# EAGLE design meld_all_non_inv (EAGLE 7.5.0)
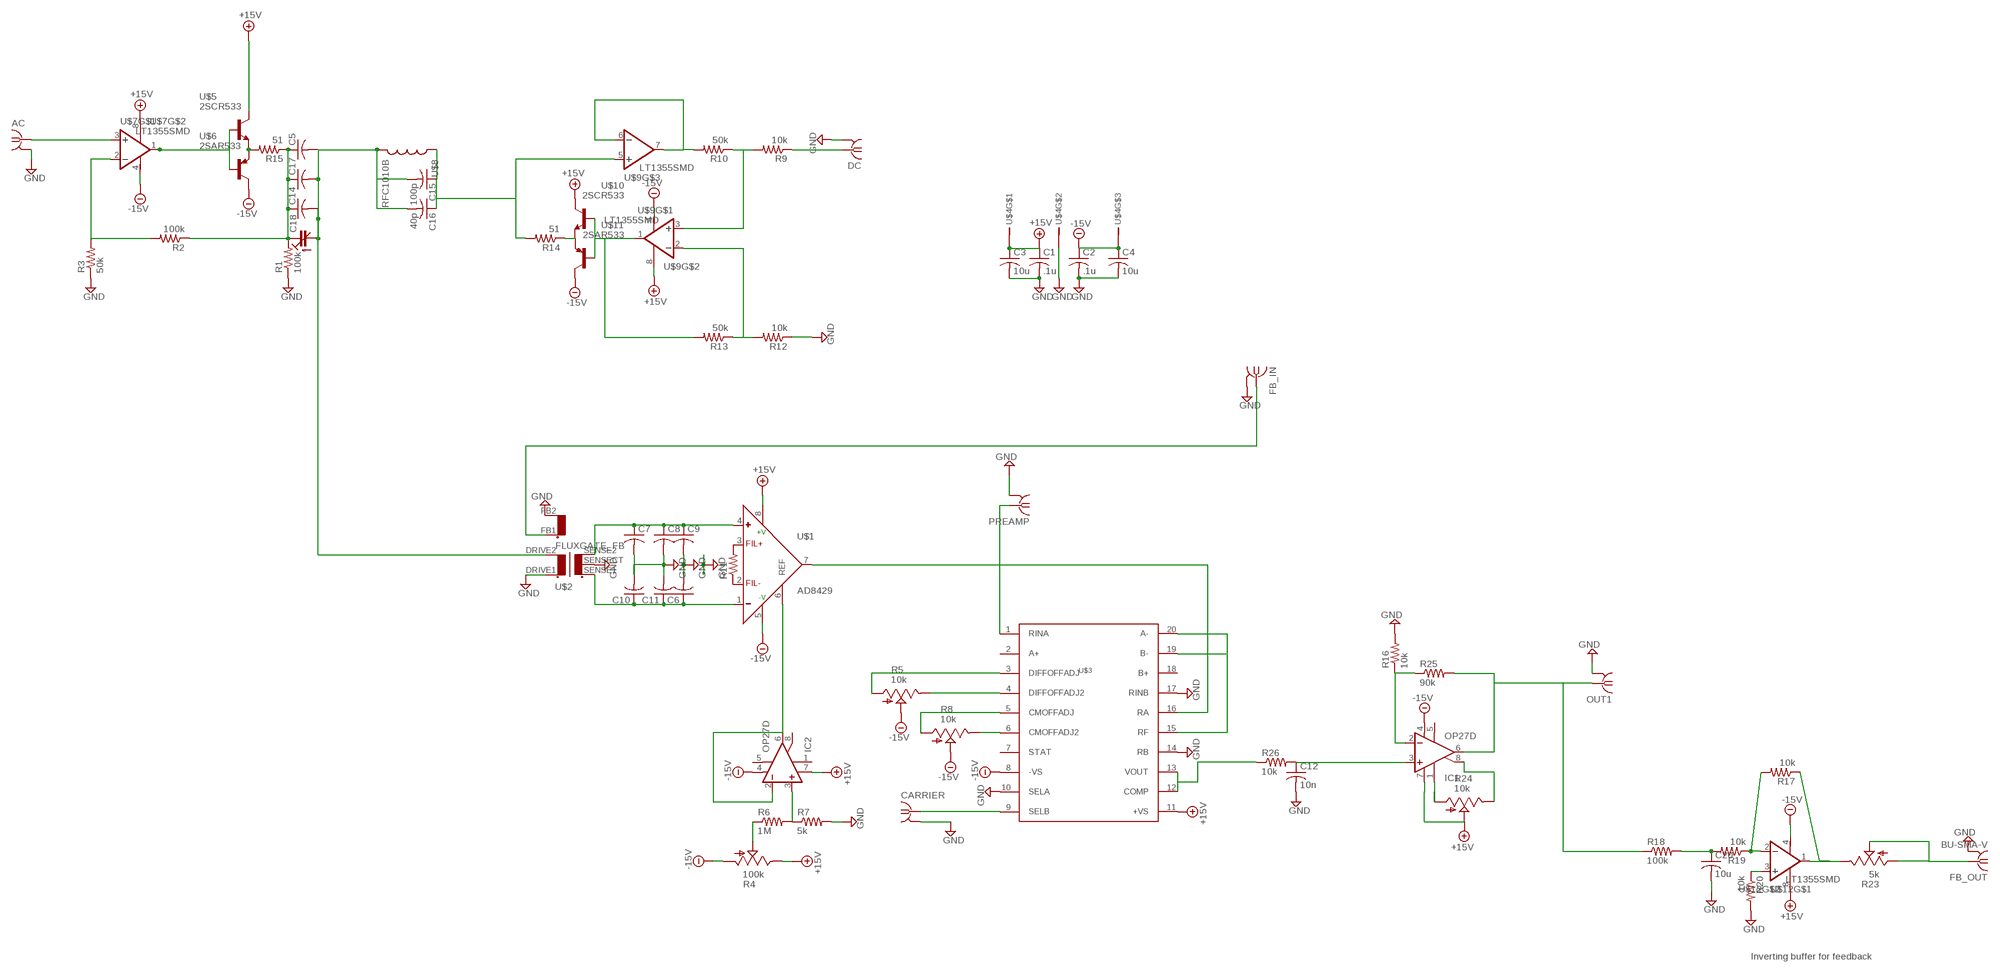
[diagram p0: schematic, sheet 1]

## Parts
AC  SMA-142-0701-851/861  [J502-ND-142-0701-851/861]
C1  .1u  C-USC1206  [C1206]
C2  .1u  C-USC1206  [C1206]
C3  10u  C-USC1206  [C1206]
C4  10u  C-USC1206  [C1206]
C5  C-USC0805  [C0805]
C6  C-USC0805  [C0805]
C7  C-USC0805  [C0805]
C8  C-USC0805  [C0805]
C9  C-USC0805  [C0805]
C10  C-USC0805  [C0805]
C11  C-USC0805  [C0805]
C12  10n  C-USC0805  [C0805]
C14  C-USC0805  [C0805]
C15  100p  C-USC0805  [C0805]
C16  40p  C-USC0805  [C0805]
C17  C-USC0805  [C0805]
C18  C-TRIMM  [SGC3S]
C20  10u  C-USC1206  [C1206]
CARRIER  SMA-142-0701-851/861  [J502-ND-142-0701-851/861]
DC  SMA-142-0701-851/861  [J502-ND-142-0701-851/861]
FB_IN  SMA-142-0701-851/861  [J502-ND-142-0701-851/861]
FB_OUT  BU-SMA-V  [BU-SMA-V]
IC1  OP27D  [SO08]
IC2  OP27D  [SO08]
OUT1  SMA-142-0701-851/861  [J502-ND-142-0701-851/861]
PREAMP  SMA-142-0701-851/861  [J502-ND-142-0701-851/861]
R1  100k  R-US_R0805  [R0805]
R2  100k  R-US_R0805  [R0805]
R3  50k  R-US_R0805  [R0805]
R4  100k  TRIM_US-B64Y  [B64Y]
R5  10k  TRIM_US-B64Y  [B64Y]
R6  1M  R-US_R0805  [R0805]
R7  5k  R-US_R0805  [R0805]
R8  10k  TRIM_US-B64Y  [B64Y]
R9  10k  R-US_R0805  [R0805]
R10  50k  R-US_R0805  [R0805]
R11  R-US_R0805  [R0805]
R12  10k  R-US_R0805  [R0805]
R13  50k  R-US_R0805  [R0805]
R14  51  R-US_R2512  [R2512]
R15  51  R-US_R2512  [R2512]
R16  10k  R-US_R0805  [R0805]
R17  10k  R-US_R0805  [R0805]
R18  100k  R-US_R0805  [R0805]
R19  10k  R-US_R0805  [R0805]
R20  10k  R-US_R0805  [R0805]
R23  5k  TRIM_US-B64Y  [B64Y]
R24  10k  TRIM_US-B64Y  [B64Y]
R25  90k  R-US_R0805  [R0805]
R26  10k  R-US_R0805  [R0805]
U$1  AD8429  AD8428  [SO8]
U$2  FLUXGATE_FB  [PARA_FB]
U$3  AD630  [SOIC20R]
U$4  B3B-AM  [B3B-AM]
U$5  2SCR533  [SOT89-BCE]
U$6  2SAR533  [SOT89-BCE]
U$7  LT1355SMD  [SOIC8]
U$8  RFC1010B  [186KE]
U$9  LT1355SMD  [SOIC8]
U$10  2SCR533  [SOT89-BCE]
U$11  2SAR533  [SOT89-BCE]
U$12  LT1355SMD  [SOIC8]

## Nets
+15V [power]: C1.1 C3.1 IC1.7(V+) IC2.7(V+) R4.E R24.S U$1.8(+V) U$3.11(+VS) U$4.1 U$5.C U$7.8(V+) U$9.8(V+) U$10.C U$12.8(V+)
-15V [power]: C2.1 C4.1 IC1.4(V-) IC2.4(V-) R4.A R5.S R8.S U$1.5(-V) U$3.8(-VS) U$4.3 U$6.C U$7.4(V-) U$9.4(V-) U$11.C U$12.4(V-)
GND [power]: AC.G@1 AC.G@2 AC.G@3 AC.G@4 C1.2 C2.2 C3.2 C4.2 C6.2 C7.2 C8.2 C9.2 C10.2 C11.2 C12.2 C20.2 CARRIER.G@1 CARRIER.G@2 CARRIER.G@3 CARRIER.G@4 DC.G@1 DC.G@2 DC.G@3 DC.G@4 FB_IN.G@1 FB_IN.G@2 FB_IN.G@3 FB_IN.G@4 FB_OUT.2 FB_OUT.3 FB_OUT.4 FB_OUT.5 OUT1.G@1 OUT1.G@2 OUT1.G@3 OUT1.G@4 PREAMP.G@1 PREAMP.G@2 PREAMP.G@3 PREAMP.G@4 R1.1 R3.1 R7.2 R12.1 R16.2 R20.2 U$2.DRIVE1 U$2.FB2 U$2.SENSECT U$3.10(SELA) U$3.14(RB) U$3.17(RINB) U$4.2
N$1: C7.1 C8.1 C9.1 U$1.4(+) U$2.SENSE2
N$2: C6.1 C10.1 C11.1 U$1.1(-) U$2.SENSE1
N$3: R11.2 U$1.3(FIL+)
N$4: PREAMP.1 U$1.7(OUT) U$3.1(RINA) U$3.16(RA)
N$5: CARRIER.1 U$3.9(SELB)
N$6: R15.2 U$5.E U$6.E
N$7: U$3.15(RF) U$3.19(B-) U$3.20(A-)
N$8: U$5.B U$6.B U$7.1(OUT)
N$9: C20.1 R18.2 R19.2
N$10: FB_OUT.1 R23.A R23.S
N$11: R2.2 R3.2 U$7.2(-IN)
N$12: R5.A U$3.3(DIFFOFFADJ)
N$13: IC2.2(-IN) IC2.6(OUT) U$1.6(REF)
N$14: IC2.3(+IN) R6.2 R7.1
N$15: R4.S R6.1
N$16: R5.E U$3.4(DIFFOFFADJ2)
N$17: R8.A U$3.5(CMOFFADJ)
N$18: R8.E U$3.6(CMOFFADJ2)
N$19: FB_IN.1 U$2.FB1
N$20: C5.1 C14.1 C17.1 C18.P$2(E) R1.2 R2.1 R15.1
N$21: AC.1 U$7.3(+IN)
N$22: R11.1 U$1.2(FIL-)
N$23 [power]: C5.2 C14.2 C15.2 C16.2 C17.2 C18.P$1(A) U$2.DRIVE2 U$8.P$2
N$24: R14.1 U$10.E U$11.E
N$25: R13.2 U$9.1(OUT) U$10.B U$11.B
N$26: R10.2 U$9.6(-IN) U$9.7(OUT)
N$27: R9.2 R10.1 U$9.3(+IN)
N$28: DC.1 R9.1
N$29: R12.2 R13.1 U$9.2(-IN)
N$30: C15.1 C16.1 R14.2 U$8.P$1 U$9.5(+IN)
N$31: IC1.2(-IN) R16.1 R25.1
N$32: IC1.6(OUT) OUT1.1 R18.1 R25.2
N$33: R17.2 R19.1 U$12.2(-IN)
N$34: R26.1 U$3.12(COMP) U$3.13(VOUT)
N$35: C12.1 IC1.3(+IN) R26.2
N$36: R17.1 R23.E U$12.1(OUT)
N$37 [power]: R20.1 U$12.3(+IN)
N$42: IC1.1(ON1) R24.A
N$43: IC1.8(ON2) R24.E
Unconnected: IC1.5(OPT) IC2.1(ON1) IC2.5(OPT) IC2.8(ON2) U$3.2(A+) U$3.7(STAT) U$3.18(B+) U$7.5(+IN) U$7.6(-IN) U$7.7(OUT) U$12.5(+IN) U$12.6(-IN) U$12.7(OUT)

## Notes on the sheet
- Inverting buffer for feedback

## Library data of the parts
AC CARRIER DC FB_IN OUT1 PREAMP = con-coax:SMA-: SMA 50 Ohm End Launch Jack Receptacle - Round Contact Johnson Components Source: www.johnsoncomponents.com .. J502-ND.pdf; MF: JOHNSON COMPONENTS; MPN: 142-0701-851; OC_FARNELL: 1019325; OC_NEWARK: 99F6798
C1-C12 C14-C17 C20 = rcl:C-US: CAPACITOR, American symbol
C18 = sprague:C-TRIMM: Trimm capacitor
FB_OUT = con-coax:BU-SMA-V: FEMALE SMA CONNECTOR Radiall distributor RS 112-3794; OC_FARNELL: unknown; OC_NEWARK: unknown
IC1 IC2 = linear:OP27: OP AMP
R1-R3 R6 R7 R9-R15 = rcl:R-US_: RESISTOR, American symbol
R4 R5 R8 R23 R24 = pot:TRIM_US-: POTENTIOMETER
R16-R20 R25 R26 = resistor:R-US_: RESISTOR, American symbol
U$1 = analog-devices:AD8428
U$2 = darpa:FLUXGATE_FB
U$3 = analog-devices:AD630
U$4 = con-jst:B3B-AM
U$5 U$10 = transistor:2SCR533
U$6 U$11 = transistor:2SAR533
U$7 U$9 U$12 = linear-technology:LT1355
U$8 = inductor-coilcraft:RFC1010B

## Net classes
0 default: width 0.406 mm
1 power: width 0.61 mm

## Board
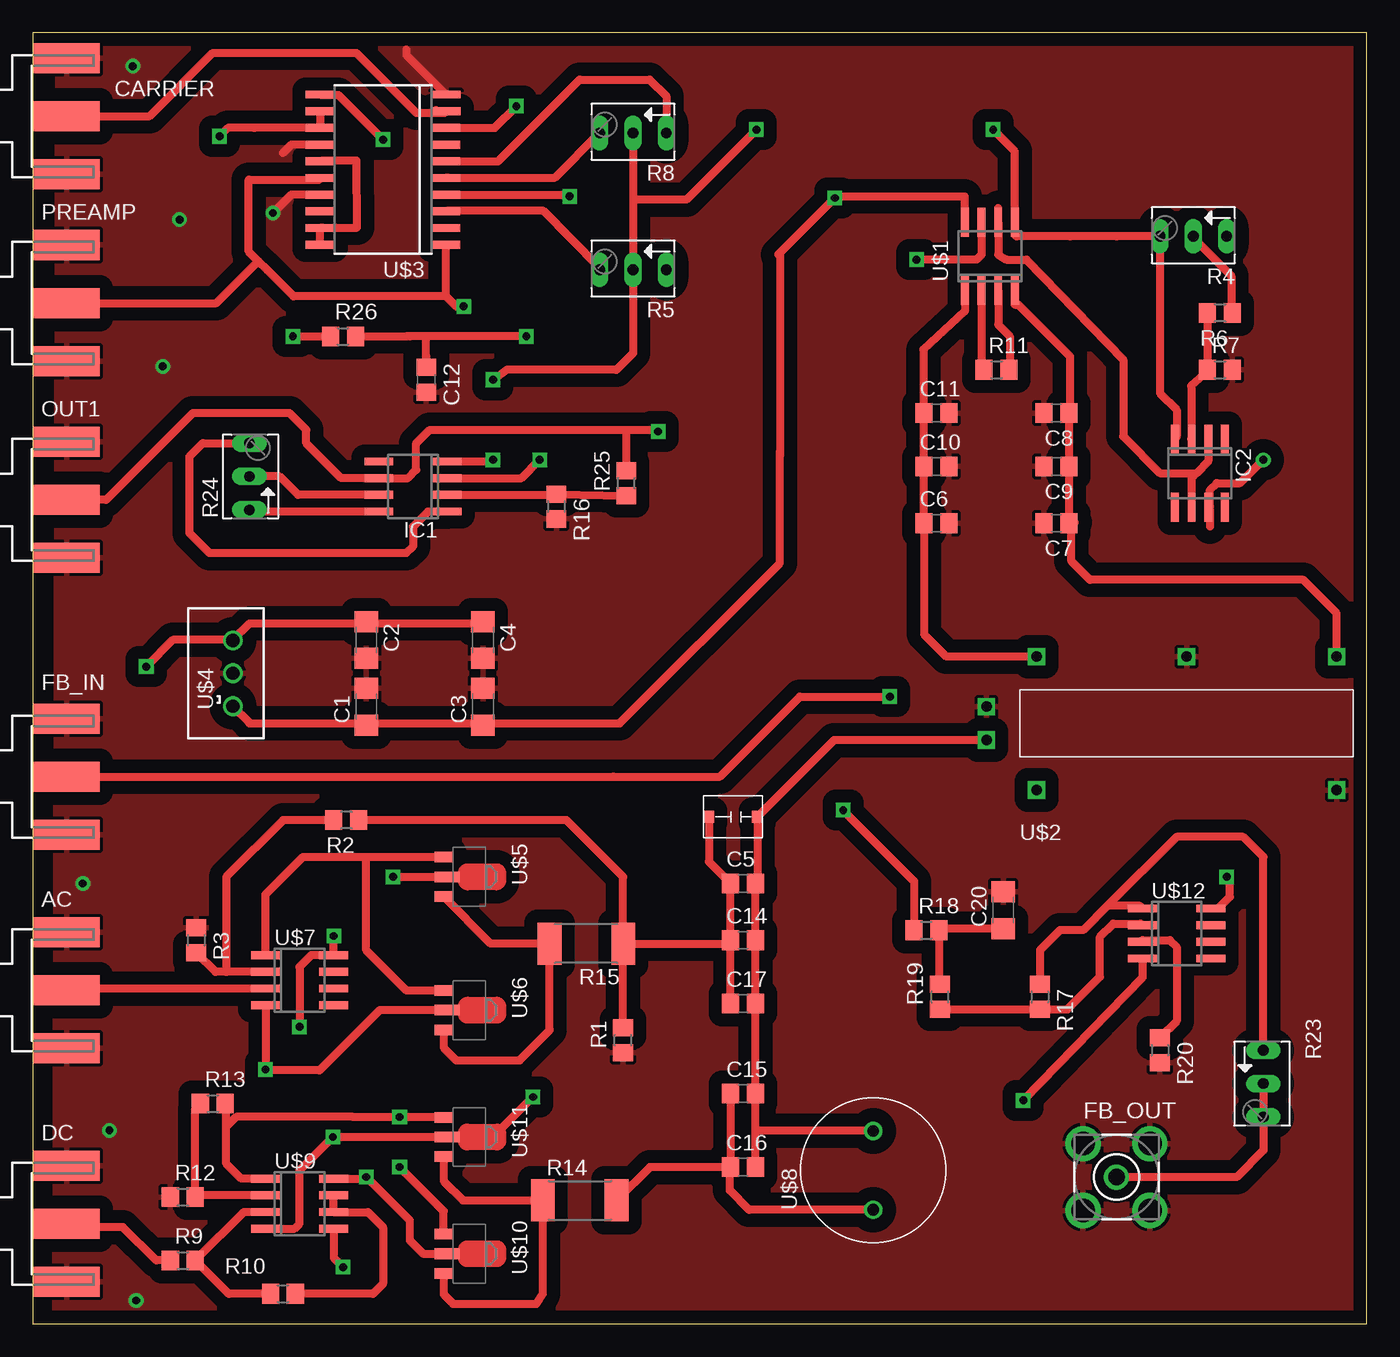
[diagram p1: board, top side]
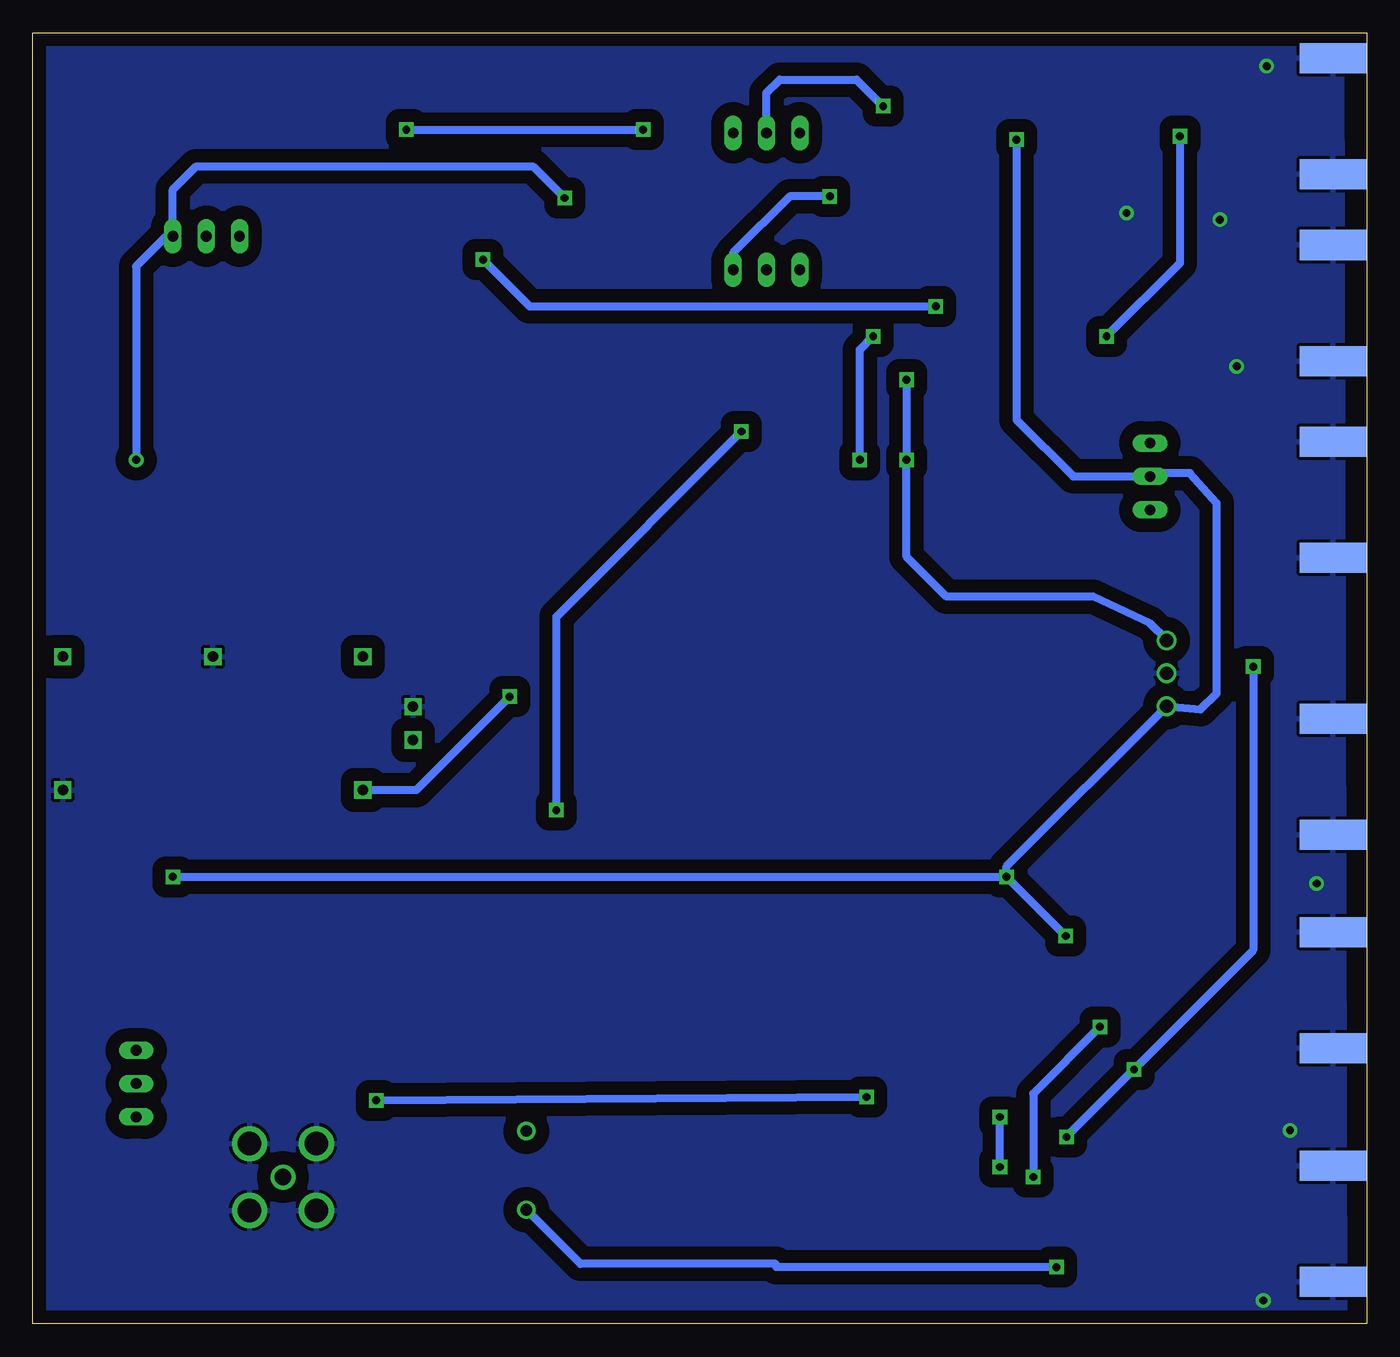
[diagram p2: board, bottom side, seen from below]

Size 101.6 x 98.3 mm. Coordinates in mm from the lower left corner, seen from the top.
Outline: 0,0 101.6,0 101.6,98.3 0,98.3 0,0
Copper layers (1*16): Top 0.035mm / dielectric 1.5mm / Bottom 0.035mm
Design rules "bac *": minimum track width 10mil, minimum drill 10mil, track to track 5mil, track to pad 10mil, pad to pad 10mil, via to via 10mil, smd to smd 10mil, copper to edge 40mil, drill to drill 10mil, minimum pad ring 10mil, minimum via ring 10mil, stop-mask expansion 4mil, vias tented up to drill 0mil, thermal gap 10mil

### Footprints (pad centres in the part's own frame; a part is rotated, then mirrored left to right if it is on the bottom)
J502-ND-142-0701-851/861 = smd 5.08 x 2.286: 1 2.565,0; G@1 2.565,4.42; G@2 2.565,-4.42 | smd 5.08 x 2.286 bottom: G@3 2.565,4.42; G@4 2.565,-4.42
C1206 = smd 1.6 x 1.8: 1 -1.4,0; 2 1.4,0
C0805 = smd 1.3 x 1.5: 1 -0.95,0; 2 0.95,0
SGC3S = smd 0.9 x 0.8: P$1 0,1.85; P$2 0,-1.85
BU-SMA-V = drill 1.27: 1 0,0 | drill 1.778: 2 -2.55,2.55; 3 2.55,2.55; 4 2.55,-2.55; 5 -2.55,-2.55
SO08 = smd 0.6 x 2.2: 1 -1.905,-2.6; 2 -0.635,-2.6; 3 0.635,-2.6; 4 1.905,-2.6; 5 1.905,2.6; 6 0.635,2.6; 7 -0.635,2.6; 8 -1.905,2.6
R0805 = smd 1.3 x 1.5: 1 -0.95,0; 2 0.95,0
B64Y = drill 0.813 long: A 2.54,0; E -2.54,0; S 0,0
R2512 = smd 1.8 x 3.2: 1 -2.8,0; 2 2.8,0
SO8 = smd 0.6 x 2.2: 1 -1.905,-2.6; 2 -0.635,-2.6; 3 0.635,-2.6; 4 1.905,-2.6; 5 1.905,2.6; 6 0.635,2.6; 7 -0.635,2.6; 8 -1.905,2.6
PARA_FB = drill 0.8 square: DRIVE1 1.27,-2.54; DRIVE2 3.81,-2.54; FB1 7.62,1.27; FB2 7.62,24.13; SENSE1 -2.54,1.27; SENSE2 -2.54,24.13; SENSECT -2.54,12.7
SOIC20R = smd 0.6 x 2.2: 1 -5.715,-4.775; 2 -4.445,-4.775; 3 -3.175,-4.775; 4 -1.905,-4.775; 5 -0.635,-4.775; 6 0.635,-4.775; 7 1.905,-4.775; 8 3.175,-4.775; 9 4.445,-4.8; 10 5.715,-4.8; 11 5.715,4.8; 12 4.445,4.8; 13 3.175,4.8; 14 1.905,4.8; 15 0.635,4.8; 16 -0.635,4.8; 17 -1.905,4.8; 18 -3.175,4.8; 19 -4.445,4.8; 20 -5.715,4.8
B3B-AM = drill 1: 1 -2.5,0; 2 0,0; 3 2.5,0
SOT89-BCE = smd 0.8 x 1.4: B -1.499,-1.981; E 1.499,-1.981 | smd 0.8 x 1.9: C 0,-1.727
SOIC8 = smd 0.6 x 2.2: 1 -1.905,-2.6; 2 -0.635,-2.6; 3 0.635,-2.6; 4 1.905,-2.6; 5 1.905,2.6; 6 0.635,2.6; 7 -0.635,2.6; 8 -1.905,2.6
186KE = drill 0.9: P$1 -3,0; P$2 3,0

### Placement (x,y rotation side)
AC  0,25.4 0 top
C1  25.4,46.99 90 top
C2  25.4,52.07 270 top
C3  34.29,46.99 90 top
C4  34.29,52.07 270 top
C5  54.1,33.53 0 top
C6  68.83,60.96 0 top
C7  77.98,60.96 180 top
C8  77.98,69.34 180 top
C9  77.98,65.28 180 top
C10  68.83,65.28 0 top
C11  68.83,69.34 0 top
C12  29.97,71.88 270 top
C14  54.1,29.21 0 top
C15  54.1,17.53 0 top
C16  54.1,11.94 0 top
C17  54.1,24.38 0 top
C18  53.34,38.61 270 top
C20  73.91,31.5 90 top
CARRIER  0,91.95 0 top
DC  0,7.62 0 top
FB_IN  0,41.66 0 top
FB_OUT  82.55,11.18 0 top
IC1  28.96,63.75 90 top
IC2  88.9,64.77 180 top
OUT1  0,62.74 0 top
PREAMP  0,77.72 0 top
R1  44.96,21.59 90 top
R2  23.88,38.35 180 top
R3  12.45,29.21 270 top
R4  88.39,82.8 180 top
R5  45.72,80.26 180 top
R6  90.42,76.96 180 top
R7  90.42,72.64 0 top
R8  45.72,90.68 180 top
R9  11.43,4.83 0 top
R10  19.05,2.29 0 top
R11  73.41,72.64 0 top
R12  11.43,9.65 0 top
R13  13.72,16.76 0 top
R14  41.66,9.4 0 top
R15  42.16,28.96 180 top
R16  39.88,62.23 270 top
R17  76.71,24.89 270 top
R18  68.07,29.97 0 top
R19  69.09,24.89 90 top
R20  85.85,20.83 270 top
R23  93.73,18.29 270 top
R24  16.51,64.52 90 top
R25  45.21,64.01 90 top
R26  23.62,75.18 0 top
U$1  72.9,81.28 0 top
U$2  75.18,48.26 270 top
U$3  26.67,87.88 90 top
U$4  15.24,49.53 90 top
U$5  33.27,34.04 270 top
U$6  33.27,23.88 270 top
U$7  20.32,26.16 270 top
U$8  64.01,11.68 90 top
U$9  20.32,9.14 270 top
U$10  33.27,5.33 270 top
U$11  33.27,14.22 270 top
U$12  87.12,29.72 270 top

### Tracks (layer width: path | path; a pad name or v marks a point on that pad's centre or on a via)
+15V  (via drill 0.6)
  Top 0.61: 25.4,45.72 16.51,45.72 16.51,45.76 U$4.1 15.2,47.03 | 25.4,45.72 34.29,45.72 | 34.29,45.72 C3.1 | 25.4,45.72 C1.1 | v26.67,90.17 23.27,93.57 22,93.57 U$3.11 | v93.73,65.79 91.95,64.01 90.17,64.01 89.66,63.5 89.66,62.23 IC2.7 89.66,61.98 89.66,60.71 | U$1.8 70.99,85.83 70.97,85.85 61.21,85.85 | U$9.8 25.53,11.05 | 25.53,11.05 28.7,7.87 28.7,6.35 29.72,5.33 U$10.C | v22.92,29.52 U$7.8 21.21,28.07 20.32,27.18 v20.32,22.61 | v27.43,34.04 U$5.C | v25.4,11.18 25.53,11.05 | IC1.7 20.19,63.12 18.8,64.52 R24.S | v61.09,85.72 56.77,81.41 56.9,81.41 56.9,66.04 | v61.09,85.72 61.21,85.85 | U$12.8 90.3,31.62 91.19,32.51 91.19,33.78 v90.93,34.04 | 34.29,45.72 44.7,45.72 56.9,57.91 56.9,66.04 | 56.9,66.04 56.9,66.4 | v61.09,85.72 61.21,85.85
  Bottom 0.61: v26.67,90.17 26.67,77.98 26.67,68.83 22.35,64.52 R24.S 16.26,64.77 13.46,64.77 11.43,62.48 11.43,48.01 12.66,46.78 U$4.1 27.43,34.84 v27.43,34.04 | v93.73,65.79 93.73,80.52 91.44,82.8 R4.E 90.93,86.36 89.15,88.14 63.5,88.14 v61.09,85.72 | v22.92,29.52 v27.43,34.04 | v20.32,22.61 25.4,17.53 v25.4,11.18 | v90.93,34.04 37.85,34.04 v27.43,34.04
-15V  (via drill 0.6)
  Top 0.61: 25.4,53.34 18.8,53.34 16.51,53.34 15.24,52.07 | 15.24,52.07 U$4.3 | 25.4,53.34 34.29,53.34 C4.1 | 25.4,53.34 C2.1 | R5.S 45.72,83.06 45.72,85.6 | R5.S 45.72,80.01 45.72,73.91 44.45,72.64 36.07,72.64 v35.05,71.88 | IC2.4 87.12,67.56 87.12,69.6 85.85,70.87 R4.A 82.55,82.8 78.99,82.8 74.93,82.8 | U$1.5 74.8,82.93 | 74.8,82.93 74.93,82.8 | U$9.4 19.94,7.24 20.32,7.62 20.32,11.68 v22.86,14.22 U$11.C 35.05,14.22 v38.1,17.27 | U$7.4 v17.72,19.36 17.78,19.3 21.84,19.3 26.42,23.88 U$6.C | IC1.4 34.92,65.66 v35.05,65.79 | U$12.4 84.52,26.36 v75.44,17.02 | 15.24,52.07 10.67,52.07 v8.64,50.04 | 74.93,82.8 74.8,82.93 | 74.8,82.93 74.8,89.28 v73.15,90.93 | v55.12,90.93 49.78,85.6 45.72,85.6 | R8.S 45.72,85.6 | 45.72,85.6 45.72,83.82 R5.S | U$3.8 35.18,91.06 v36.83,92.71
  Bottom 0.61: v22.86,14.22 v17.72,19.36 17.27,19.81 | v35.05,71.88 v35.05,65.79 35.05,58.42 32,55.37 20.83,55.37 16.51,53.34 15.24,52.07 | v75.44,17.02 v38.1,17.27 | 15.24,52.07 U$4.3 15.24,52.07 | 14.99,22.1 17.27,19.81 | v8.64,50.04 8.64,28.45 17.27,19.81 | v73.15,90.93 v55.12,90.93 | R8.S 45.72,93.73 44.7,94.74 38.86,94.74 37.59,93.47 | 37.59,93.47 v36.83,92.71 37.59,93.47
GND  (via drill 0.6)
  Top 0.61: U$3.17 19.68,85.98 v18.29,84.58 | 28.45,97.03 28.45,96.62 U$3.10 | U$3.14 19.68,89.79 19.05,89.15
  Bottom 0.61: v18.29,84.58 18.03,84.58
  other vias: 11.18,84.07 9.91,72.9 5.84,14.73 3.81,33.53 7.87,1.78 7.62,95.76
  pour Bottom (isolate 1.016): 1.91,98.3 101.6,98.3 101.35,0 1.65,0
  pour Top (isolate 1.016): 1.91,98.3 101.6,98.3 101.35,0 1.65,0
N$1
  Top 0.61: U$1.4 74.8,77.6 75.06,77.6 78.99,73.66 78.99,69.66 C8.1 C9.1 C7.1 | C7.1 79.18,61.03 79.36,61.03 | C7.1 79.11,60.78 79.11,58.05 80.52,56.64 96.77,56.64 99.31,54.1 U$2.SENSE2
N$2
  Top 0.61: 68.07,69.53 C11.1 67.88,68.83 67.82,68.9 | U$1.1 70.99,77.09 67.82,74.17 67.82,68.9 | 67.82,68.9 67.82,65.02 68.07,64.77 67.88,64.96 C10.1 C6.1 67.89,60.2 67.89,52.51 69.6,50.8 U$2.SENSE1
N$3
  Top 0.61: U$1.3 73.53,76.07 74.42,75.18 74.42,72.71 R11.2
N$4  (via drill 0.6)
  Top 0.61: U$3.16 21.84,87.12 16.46,87.12 16.46,81.64 17.17,80.92 | 17.17,80.92 17.88,80.21 19.86,78.23 31.5,78.23 | 31.39,82.04 U$3.1 | 17.17,80.92 13.97,77.72 PREAMP.1 | v67.31,81.03 71.88,81.03 72.26,81.41 U$1.7 | v32.82,77.47 32.26,77.47 31.5,78.23 | 31.5,78.23 31.5,82.12 U$3.1 | U$3.1 31.45,78.28 31.5,78.23
  Bottom 0.61: 63.75,77.47 v67.31,81.03 63.75,77.47 | 63.75,77.47 v32.82,77.47
N$5
  Top 0.61: 30.68,92.41 U$3.9 31.34,92.2 29.21,92.2 24.64,96.77 13.72,96.77 8.89,91.95 CARRIER.1
N$6
  Top 0.61: U$5.E 34.87,28.96 R15.2 39.37,22.35 37.08,20.07 32.26,20.07 31.29,21.03 U$6.E
N$7
  Top 0.61: U$3.15 22.05,88.57 23.06,88.57 24.66,88.57 24.69,83.46 23.06,83.46 22.05,83.46 U$3.19 21.84,83.26 21.84,82.25 U$3.20
N$8
  Top 0.61: U$7.1 17.72,32.71 20.57,35.56 25.4,35.56 | 25.4,35.56 31.27,35.56 U$5.B | U$6.B 28.47,25.38 25.4,28.45 25.4,35.56
N$9
  Top 0.61: 69.02,25.91 R19.2 69.02,25.91 | C20.1 69.15,30.1 R18.2 69.02,25.91
N$10
  Top 0.61: R23.S R23.A 93.73,13.21 91.69,11.18 FB_OUT.1
N$11
  Top 0.61: U$7.2 14.73,26.8 | 14.73,26.8 13.91,26.8 R3.2 | R2.2 19.05,38.35 14.73,34.04 14.73,26.8
N$12
  Top 0.61: U$3.3 31.57,84.73 38.89,84.73 43.18,80.42 R5.A
N$13
  Top 0.61: 73.53,84.96 U$1.6 73.53,81.41 74.17,81.03 75.69,81.03 83.06,73.41 83.06,67.56 85.85,64.77 88.65,64.77 | IC2.2 89.53,65.66 88.65,64.77 | 88.65,64.77 88.39,64.52 | IC2.6 88.27,64.39 88.39,64.52 | 88.65,64.77 88.39,64.52
N$14
  Top 0.61: R6.2 89.46,72.69 R7.1 89.46,72.49 88.24,71.42 88.24,67.36 IC2.3
N$15
  Top 0.61: R6.1 91.29,76.96 91.29,79.81 88.44,82.65 R4.S
N$16  (via drill 0.6)
  Top 0.61: U$3.4 40.77,85.98 v40.89,85.85
  Bottom 0.61: 48.26,80.21 R5.E 48.26,81.53 43.94,85.85 v40.89,85.85
N$17
  Top 0.61: U$3.5 31.6,87.27 39.78,87.27 R8.A
N$18
  Top 0.61: U$3.6 35.43,88.52 41.66,94.74 46.99,94.74 48.26,93.47 R8.E
N$19  (via drill 0.6)
  Top 0.61: FB_IN.1 44.2,41.66 52.32,41.66 58.42,47.75 v65.28,47.75
  Bottom 0.61: v65.28,47.75 72.39,40.64 U$2.FB1
N$20
  Top 0.61: C17.1 C14.1 | C14.1 C5.1 51.49,35.19 C18.P$2 | C14.1 52.9,28.96 R15.1 | R1.2 R15.1 | R15.1 44.96,34.04 40.64,38.35 R2.1
N$21
  Top 0.61: 3.68,25.53 3.56,25.4 AC.1 | AC.1 2.03,25.4 1.78,25.65 | U$7.3 2.31,25.53 AC.1
N$22
  Top 0.61: U$1.2 72.26,72.84 R11.1
N$23
  Top 0.61: 55.32,11.67 C16.2 55.05,14.73 | 55.05,14.73 C15.2 C17.2 C14.2 C5.2 55.19,33.67 C18.P$1 61.03,44.45 U$2.DRIVE2 | U$8.P$2 55.1,14.68 55.05,14.73
N$24
  Top 0.61: U$11.E 31.29,10.87 32.77,9.4 R14.1 38.86,2.29 38.35,1.52 32,1.52 31.29,2.23 U$10.E
N$25  (via drill 0.6)
  Top 0.61: U$9.1 15.88,11.05 14.73,12.19 14.73,14.99 | 14.73,14.99 14.73,16.7 R13.2 | U$11.B 31.27,15.75 v27.94,15.75 24.38,15.75 15.49,15.75 14.73,14.99 | U$10.B 31.29,8.59 v27.94,11.94
  Bottom 0.61: v27.94,11.94 v27.94,15.75
N$26
  Top 0.61: U$9.7 U$9.6 25.53,8.51 26.67,7.37 26.67,3.05 25.91,2.29 R10.2
N$27
  Top 0.61: U$9.3 16.06,8.51 R9.2 14.92,2.29 R10.1
N$28
  Top 0.61: R9.1 9.4,4.83 6.86,7.37 2.82,7.37 DC.1
N$29
  Top 0.61: U$9.2 12.38,9.78 R12.2 12.38,16.38 R13.1
N$30  (via drill 0.6)
  Top 0.61: U$9.5 22.92,5.02 v23.62,4.32 | C15.1 53.15,12.45 | 53.15,12.45 C16.1 47,11.94 R14.2 | U$8.P$1 54.56,8.68 53.09,10.16 53.09,12.38 53.15,12.45
  Bottom 0.61: v23.62,4.32 44.96,4.32 45.01,4.57 59.9,4.57 U$8.P$1
N$31
  Top 0.61: 45.21,63.12 R25.1 R16.1 | 39.62,63.12 R16.1 | IC1.2 39.62,63.12 | 39.62,63.12 R16.1
N$32  (via drill 0.6)
  Top 0.61: 45.21,68.07 30.23,68.07 29.21,67.06 29.21,65.02 28.57,64.39 IC1.6 23.5,64.39 20.83,67.06 20.83,68.07 19.56,69.34 12.19,69.34 5.59,62.74 OUT1.1 | 45.21,68.07 47.5,68.07 v47.62,67.94 | v61.72,39.12 67.12,33.72 R18.1 | R25.2 45.21,68.07
  Bottom 0.61: v61.72,39.12 61.72,53.85 v47.62,67.94
N$33
  Top 0.61: U$12.2 84.39,30.48 82.3,30.48 81.28,29.46 81.28,26.42 78.81,23.94 R17.2 R19.1
N$34  (via drill 0.6)
  Top 0.61: U$3.12 U$3.13 16.89,91.06 14.86,91.06 v14.22,90.42 | v19.81,75.18 R26.1
  Bottom 0.61: v19.81,75.18 14.22,80.77 v14.22,90.42
N$35  (via drill 0.6)
  Top 0.61: R26.2 28.45,75.18 28.7,75.18 29.97,75.18 | IC1.3 37.21,64.39 v38.61,65.79 | v37.59,75.18 29.97,75.18 | 29.97,73.66 29.97,73.41 | 29.72,73.15 29.97,73.15 29.97,73.66 | 29.97,73.66 29.97,75.18 | C12.1 29.97,73.66
  Bottom 0.61: v38.61,65.79 38.61,74.17 v37.59,75.18
N$36
  Top 0.61: U$12.1 84.33,31.82 81.86,31.82 | 81.86,31.82 80.01,29.97 78.23,29.97 76.71,28.45 R17.1 76.58,25.97 | R23.E 93.73,35.56 92.2,37.08 87.12,37.08 81.86,31.82
N$37
  Top 0.61: U$12.3 84.52,29.21 86.61,29.21 87.12,28.7 87.12,23.05 R20.1
N$42
  Top 0.61: IC1.1 30.1,61.85 28.96,60.71 28.96,59.18 28.45,58.67 13.46,58.67 11.94,60.2 11.94,66.04 12.95,67.06 R24.A
N$43
  Top 0.61: IC1.8 16.64,61.85 R24.E